# Altium project NPI1842.PrjPcb
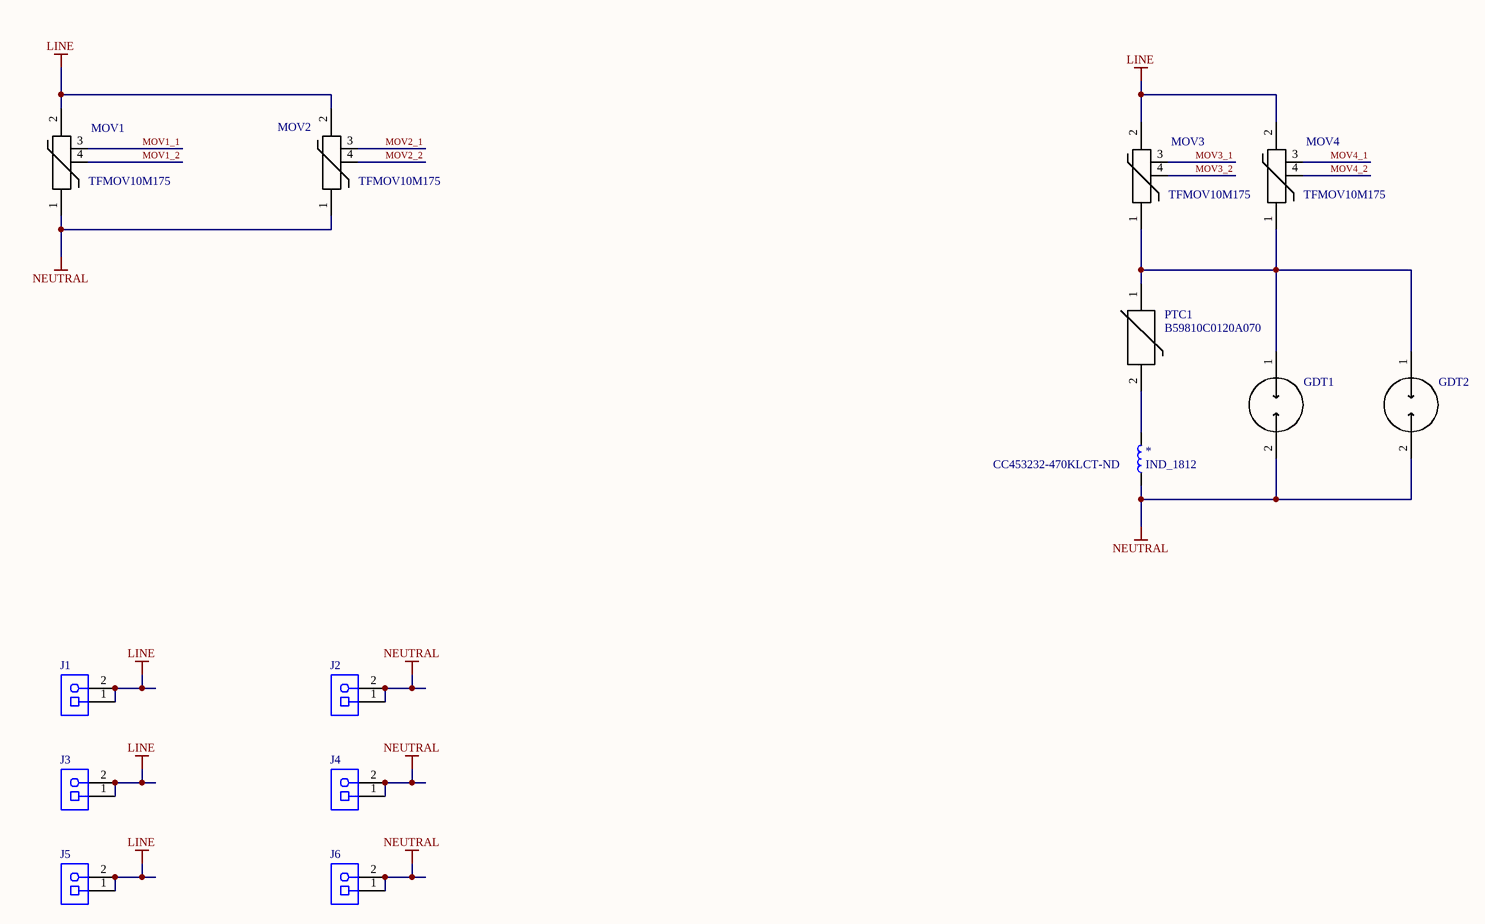
[diagram p0: Sheet1.SchDoc]
2 sheets, 75 parts. Net scope: global (net labels, ports and power ports of the same name join across sheets).
Board file: PCB1.PcbDoc
Sheets:
  Sheet1.SchDoc
  Sheet2.SchDoc

## Sheet Sheet1.SchDoc
size B; SheetNumber: 1; SheetTotal: 2

### Parts
*  IND_1812  Supplier Part Number 1: CC453232-470KLCT-ND  [IND_1812]
GDT1  B88069X2250S102  [B88069X2250S102]  (value not drawn)
GDT2  B88069X2250S102  [B88069X2250S102]  (value not drawn)
J1  1729128  [PHOE-1729128-2_V]  (value not drawn)
J2  1729128  [PHOE-1729128-2_V]  (value not drawn)
J3  1729128  [PHOE-1729128-2_V]  (value not drawn)
J4  1729128  [PHOE-1729128-2_V]  (value not drawn)
J5  1729128  [PHOE-1729128-2_V]  (value not drawn)
J6  1729128  [PHOE-1729128-2_V]  (value not drawn)
MOV1  TFMOV10M175  [TFMOV10M175]
MOV2  TFMOV10M175  [TFMOV10M175]
MOV3  TFMOV10M175  [TFMOV10M175]
MOV4  TFMOV10M175  [TFMOV10M175]
PTC1  B59810C0120A070  [B59810C0120A070]

### Nets
LINE: J1.1 J1.2 J3.1 J3.2 J5.1 J5.2 MOV1.2 MOV2.2 MOV3.2 MOV4.2
MOV1_2: MOV1.4 MOV2.4 MOV3.4 MOV4.4  [also labelled MOV2_2, MOV3_2, MOV4_2]
NEUTRAL: *.1 GDT1.2 GDT2.2 J2.1 J2.2 J4.1 J4.2 J6.1 J6.2 MOV1.1 MOV2.1
MOV1_1: MOV1.3  [project net GPIO6]
MOV2_1: MOV2.3  [project net GPIO2]
MOV3_1: MOV3.3  [project net GPIO8]
MOV4_1: MOV4.3  [project net GPIO10]
Net*_2: *.2 PTC1.2
NetGDT1_1: GDT1.1 GDT2.1 MOV3.1 MOV4.1 PTC1.1

### Library data of the parts
GDT1 GDT2 = B88069X2250S102: 230V, 20kA, 2-pole GDT
J1-J6 = CMP-2000-05815-1: PCB Terminal Block, 13.5 A, 400 V, 2-Pin THD, RoHS, Bulk; Manufacturer: Phoenix Contact; Package Version: 03/2015; No. of Rows: 1; Pitch: 5.08mm; No. of Positions: 2; Voltage Rating: 400V; Current Rating: 13500mA; Connector Type: Screw; Current: 10A; Voltage: 300V; Max Current Rating: 13.5A; Test Voltage: 4kV; Wire Gauge (Max): 26AWG; Wire Gauge (Min): 14AWG; Approvals: UL,CSA; Manufacturer URL: http://www.phoenixcontact.com/; Datasheet URL: https://datasheet.ciiva.com/16046/1729128-16046181.pdf; RoHS: TRUE; Package URL: https://www.phoenixcontact.com/online/portal/pi/pxc/product_detail_page/!ut/p/b1/3VdJjqNKFDxLH8AFycySyWY2ozFsEPOMMQaDOX1XedGL_1Vdm5YXJleknhSKeBkvI6EA8ncAo3AYoDhBQGco6KN7VURTdemj9us_IEKEZo_YHiPAEWEFmDGOHMORkqKYCORBZxgL7ZoaZYcbFFUZ3fqxSY6GOuxydWUuHqz1ynmMFygu583Bob0Ewr6Sd_l-5m-kAueHiB0jpRwZwe58wwtkpxtMYd_LmGcDRU02dRNEyWt6Y2ti5pSyJ_reIkzIulrqApdnbT11V5jnCKbYNCvhEM1MCpPByat_X379-iThf08CI5GfOPqfBeS3BRoBOdD55AKVv0iLwCMq-2BrzXWSGRH7pUGD9uwXQjiph3xL0DKQwdGa0JImiIOmBNOestqgwTHSSs2oOep-78apyXQBvNi8ZLaFjvjWvcaUEBu0MC6Wbe-d6mB0FAebo2lUWinqYaZs5DAYzV0RP9yitUjnGJ0iI9xhZkT42OCQNUJJhkgWINNQLP2JFP6OpMg3JCVg70jqHT0lvKOnhHf0lPuOnnLf0VPuWx6_dxwUIvwk5WMkT0kLL1mh61l2yZVSzG3pYV_bqo-mj6uMKwKwdnnW8Jh5RTOJzMOA5c-eJDaZQw4mTMPH02PvS_ZAqNVjVTo2WyYLkwH_KU1mmmG5kjRhDqPXLwwVHvVOjCM60-fpXvTDfMGW1PVFVS1r4e4yVDk4ZdNbkUHvqPqQSeian4UD39fNKmachqdJ1NJbyk8rXT9mXTvPk3oE5meulKGgiruPJek-4I9hTT6G8ZLOyRSm2RRVbThERQad5OS28hdt4YW4vG0stgYYzsWsK4_7y6DZMjJSCqri1kyiZR5vD7pwIrNR7QwPHTcLTI5qT7eRlpHrdGiupYlqQDJ7zy_CND8fWWBoLRXxk1RVcXiBQwbTD4Xi7KL-FuO94t9xaqweXzH; PartNumber: 1729128; Package Description: 2-Pin Through Hole Device, Body 8.1 x 10.16 mm, Pitch 5.08 mm; Datasheet Version: 12/2013; Mounting Technology: ThroughHole; Orientation: Horizontal; Package Reference: 1729128-2; Packing: Bulk; Supplier 1: Digi-Key; Manufacturer Part Number: 1729128; Category: Terminal Blocks; Stock 1: 30124; Pricing 1: 1=1.09000, 10=1.04700, 50=1.00100, 100=0.97370, 250=0.91000, 500=0.83720, 1000=0.77350, 2500=0.73710, 5000=0.69160 (USD); Mount: Through Hole; Number of Pins: 2; Color: Green; Housing Color: Green; Housing Material: Polyamide; Contact Material: Tin; Weight: 0.069842oz; Insulation Material: Nylon; Min Operating Temperature: -20°C; Max Operating Temperature: 100°C; Packaging: Bulk; Termination: Solder; Number of Positions: 2; Number of Poles: 2; Package Quantity: 50; Number of Contacts: 2; Series: MKDSN; Number of Rows: 1; Number of Levels: 1; Number of Positions Per Level: 2; Max Supply Voltage: 400V; Number of Circuits: 2; Length: 8.1mm; Width: 13.5mm; Height: 13.5mm; Depth: 8.1mm; Wire/Cable Gauge: 26AWG; Radiation Hardening: No; REACH SVHC: No SVHC; Flammability Rating: UL94 V-0; RoHS Compliant: Yes; Lead Free: Lead Free; ComponentLink1URL: https://datasheet.ciiva.com/823/1729128-823779.pdf?src-supplier=Digi-Key; ComponentLink1Description: https://datasheet.ciiva.com/823/1729128-823779.pdf?src-supplier=Digi-Key; ComponentLink2URL: https://datasheet.ciiva.com/15169/getdatasheetpartid-199310-15169845.pdf?src-supplier=Verical; ComponentLink2Description: https://datasheet.ciiva.com/15169/getdatasheetpartid-199310-15169845.pdf?src-supplier=Verical; ComponentLink3URL: https://datasheet.ciiva.com/16046/1729128-16046181.pdf?src-supplier=Onlinecomponents.com; ComponentLink3Description: https://datasheet.ciiva.com/16046/1729128-16046181.pdf?src-supplier=Onlinecomponents.com; ComponentLink4URL: https://datasheet.ciiva.com/14607/70054405-14607157.pdf?src-supplier=Allied+Electronics; ComponentLink4Description: https://datasheet.ciiva.com/14607/70054405-14607157.pdf?src-supplier=Allied+Electronics; ComponentLink5URL: https://datasheet.ciiva.com/29218/743664-da-01-en-printklemmenblock-mkdsn-1-5-2-5-08-29218154.pdf?src-supplier=Conrad; ComponentLink5Description: https://datasheet.ciiva.com/29218/743664-da-01-en-printklemmenblock-mkdsn-1-5-2-5-08-29218154.pdf?src-supplier=Conrad
MOV1-MOV4 = TFMOV10M175: TFMOV, 175V, 10KA
PTC1 = B59810C0120A070: PTC, 2.6OHM
* = IND_1812: Supplier 1: Digi-Key

## Sheet Sheet2.SchDoc
size B; SheetNumber: 2; SheetTotal: 2
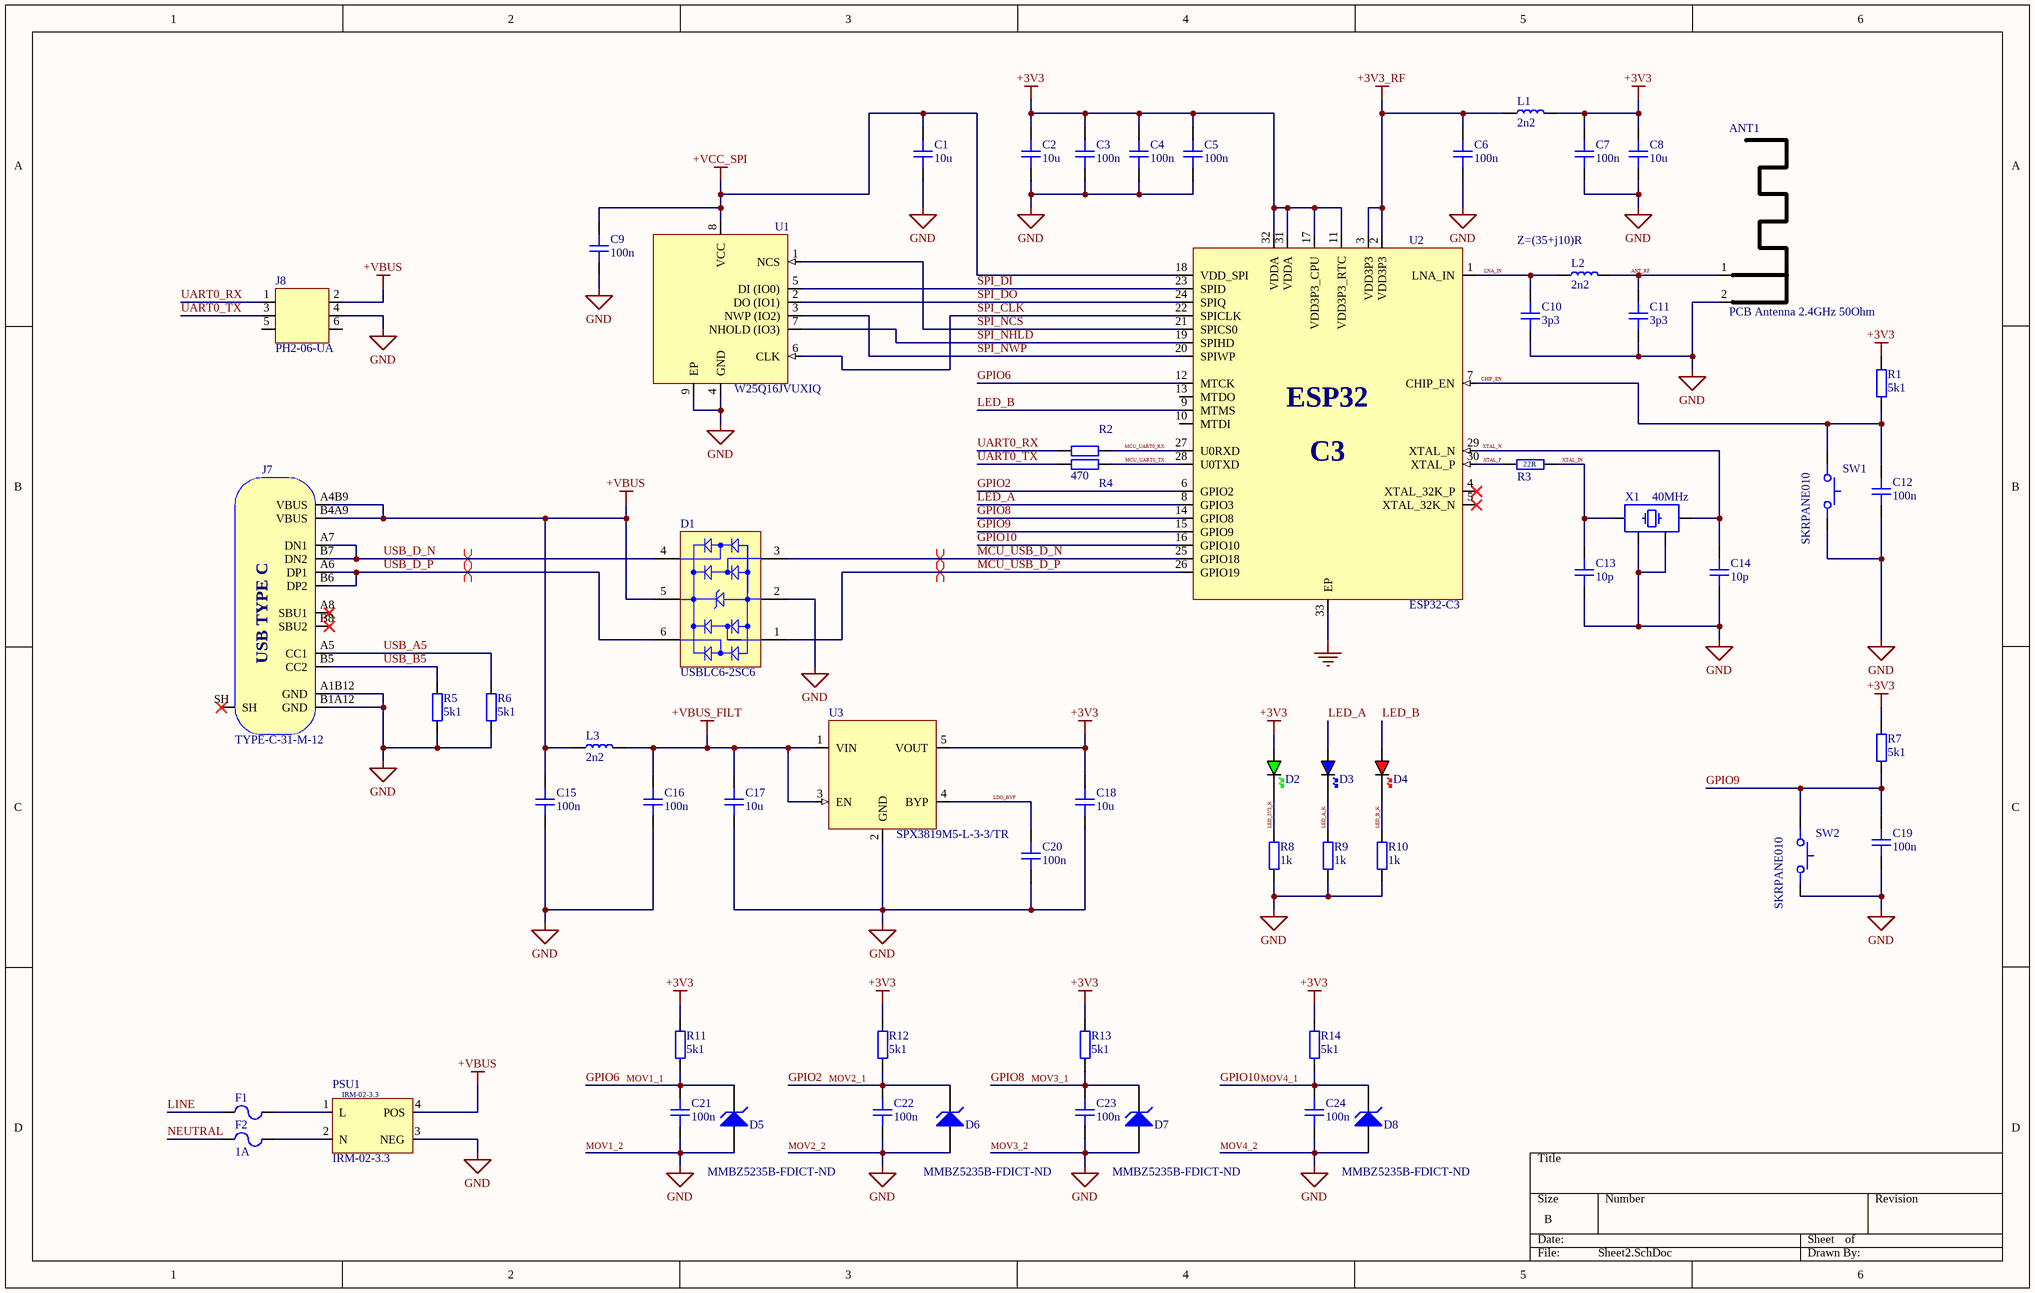
[diagram p1: Sheet2.SchDoc]

### Parts
ANT1  PCB Antenna 2.4GHz 50Ohm  [ANT_IFA_USB_2_4GHZ_50R]  (no BOM)
C1  10u  [CAP_0603]
C2  10u  [CAP_0603]
C3  100n  [CAP_0805]
C4  100n  [CAP_0805]
C5  100n  [CAP_0805]
C6  100n  [CAP_0805]
C7  100n  [CAP_0805]
C8  10u  [CAP_0603]
C9  100n  [CAP_0805]
C10  3p3  [CAP_0402]
C11  3p3  [CAP_0402]
C12  100n  [CAP_0805]
C13  10p  [CAP_0402]
C14  10p  [CAP_0402]
C15  100n  [CAP_0805]
C16  100n  [CAP_0805]
C17  10u  [CAP_0603]
C18  10u  [CAP_0603]
C19  100n  [CAP_0805]
C20  100n  [CAP_0805]
C21  100n  [CAP_0805]
C22  100n  [CAP_0805]
C23  100n  [CAP_0805]
C24  100n  [CAP_0805]
D1  USBLC6-2SC6  [STM-SOT23-6L_V]
D2  GREEN  [LED_0603_GREEN]  (value not drawn)
D3  BLUE  [LED_0603_BLUE]  (value not drawn)
D4  RED  [LED_0603_RED]  (value not drawn)
D5  Supplier Part Number 2: MMBZ5235B-FDICT-ND  [SOT23]  (hidden comment: Diode, Zener, BZX84C18)
D6  Supplier Part Number 2: MMBZ5235B-FDICT-ND  [SOT23]  (hidden comment: Diode, Zener, BZX84C18)
D7  Supplier Part Number 2: MMBZ5235B-FDICT-ND  [SOT23]  (hidden comment: Diode, Zener, BZX84C18)
D8  Supplier Part Number 2: MMBZ5235B-FDICT-ND  [SOT23]  (hidden comment: Diode, Zener, BZX84C18)
F1  1A  [FUSE_6125N]  (value not drawn)
F2  1A  [FUSE_6125N]
J7  TYPE-C-31-M-12  [TYPE-C-31-M-12]
J8  PH2-06-UA  [PH2-06-UA]
L1  2n2  [IND_0402]
L2  2n2  [IND_0402]
L3  2n2  [IND_0402]
PSU1  IRM-02-3.3  [IRM-02-3.3]
R1  5k1  [RES_0805]
R2  470  [RES_0805]  (value not drawn)
R3  22R  [RES_0402]
R4  470  [RES_0805]
R5  5k1  [RES_0805]
R6  5k1  [RES_0805]
R7  5k1  [RES_0805]
R8  1k  [RES_0805]
R9  1k  [RES_0805]
R10  1k  [RES_0805]
R11  5k1  [RES_0805]
R12  5k1  [RES_0805]
R13  5k1  [RES_0805]
R14  5k1  [RES_0805]
SW1  SKRPANE010  [SKRPANE010]
SW2  SKRPANE010  [SKRPANE010]
U1  W25Q16JVUXIQ  [USON-8-2X3MM]
U2  ESP32-C3  [QFN32-5x5]
U3  SPX3819M5-L-3-3/TR  [SOT-23-5]
X1  40MHz  [XTAL_2520]

### Nets
+3V3: C2.2 C3.2 C4.2 C5.2 C7.2 C8.2 C18.2 D2.A L1.1 R1.2 R7.2 R11.2 R12.2 R13.2 R14.2 U2.11(VDD3P3_RTC) U2.17(VDD3P3_CPU) U2.31(VDDA) U2.32(VDDA) U3.5(VOUT)
+3V3_RF: C6.2 L1.2 U2.2(VDD3P3) U2.3(VDD3P3)
+VBUS: C15.2 D1.5(VBUS) J7.A4B9(VBUS) J7.B4A9(VBUS) J8.2 L3.2 PSU1.4(POS)
+VBUS_FILT: C16.2 C17.2 L3.1 U3.1(VIN) U3.3(EN)
+VCC_SPI: C1.2 C9.2 U1.8(VCC) U2.18(VDD_SPI)
LINE: F1.1
MOV1_2: ANT1.2(GND) C1.1 C2.1 C3.1 C4.1 C5.1 C6.1 C7.1 C8.1 C9.1 C10.1 C11.1 C12.1 C13.1 C14.1 C15.1 C16.1 C17.1 C18.1 C19.1 C20.1 C21.1 C22.1 C23.1 C24.1 D1.2(GND) D5.1(A) D6.1(A) D7.1(A) D8.1(A) J7.A1B12(GND) J7.B1A12(GND) J8.4 PSU1.3(NEG) R5.1 R6.1 R8.1 R9.1 R10.1 SW1.12 SW2.12 U1.4(GND) U1.9(EP) U2.33(EP) U3.2(GND) X1.2 X1.4  [also labelled GND, MOV2_2, MOV3_2, MOV4_2]
NEUTRAL: F2.1
ANT_RF: ANT1.1(RF) C11.2 L2.1
CHIP_EN: C12.2 R1.1 SW1.34 U2.7(CHIP_EN)
GPIO2: C22.2 D6.3(K) R12.1 U2.6(GPIO2)  [also labelled MOV2_1]
GPIO6: C21.2 D5.3(K) R11.1 U2.12(MTCK)  [also labelled MOV1_1]
GPIO8: C23.2 D7.3(K) R13.1 U2.14(GPIO8)  [also labelled MOV3_1]
GPIO9: C19.2 R7.1 SW2.34 U2.15(GPIO9)
GPIO10: C24.2 D8.3(K) R14.1 U2.16(GPIO10)  [also labelled MOV4_1]
LDO_BYP: C20.2 U3.4(BYP)
LED_3V3_K: D2.K R8.2
LED_A: D3.A U2.8(GPIO3)
LED_A_K: D3.K R9.2
LED_B: D4.A U2.9(MTMS)
LED_B_K: D4.K R10.2
LNA_IN: C10.2 L2.2 U2.1(LNA_IN)
MCU_UART0_RX: R2.1 U2.27(U0RXD)
MCU_UART0_TX: R4.1 U2.28(U0TXD)
MCU_USB_D_N: D1.3(I/O_2) U2.25(GPIO18)
MCU_USB_D_P: D1.1(I/O_1) U2.26(GPIO19)
SPI_CLK: U1.6(CLK) U2.22(SPICLK)
SPI_DI: U1.5(DI_(IO0)) U2.23(SPID)
SPI_DO: U1.2(DO_(IO1)) U2.24(SPIQ)
SPI_NCS: U1.1(NCS) U2.21(SPICS0)
SPI_NHLD: U1.7(NHOLD_(IO3)) U2.19(SPIHD)
SPI_NWP: U1.3(NWP_(IO2)) U2.20(SPIWP)
UART0_RX: J8.1 R2.2
UART0_TX: J8.3 R4.2
USB_A5: J7.A5(CC1) R6.2
USB_B5: J7.B5(CC2) R5.2
USB_D_N: D1.4(I/O_3) J7.A7(DN1) J7.B7(DN2)
USB_D_P: D1.6(I/O_4) J7.A6(DP1) J7.B6(DP2)
XTAL_IN: C13.2 R3.2 X1.3
XTAL_N: C14.2 U2.29(XTAL_N) X1.1
XTAL_P: R3.1 U2.30(XTAL_P)
NetF1_2: F1.2 PSU1.1(L)
NetF2_2: F2.2 PSU1.2(N)

Not connected (* = marked no-connect by the designer): J7 A8(SBU1)* B8(SBU2)* SH*; J8 5 6; U2 4(XTAL_32K_P)* 5(XTAL_32K_N)* 10(MTDI) 13(MTDO)

### Layout directives
differential pair; differential pair class DIFF_USB: MCU_USB_D_N, MCU_USB_D_P, USB_D_N, USB_D_P

### Notes on the sheet
- (near L2) Z=(35+j10)R
- (in symbol ESP32-C3) ESP32; C3
- (in symbol TYPE-C-31-M-12) USB TYPE C

### Library data of the parts
ANT1 = ANT_IFA_USB_2_4GHZ_50R: Inverted F 2.4GHz ISM PCB Antenna 50 Ohm; ComponentLink1Description: Datasheet; ComponentLink1URL: https://www.ti.com/lit/an/swra117d/swra117d.pdf
C1 C2 C8 C17 C18 = CAP_0603_10V: Capacitor SMD 0603 10V; Manufacturer: Samsung; Manufacturer Part Number: CL10A106KP8NNNC; LCSC: C19702
C3-C7 C9 C12 C15 C16 C19-C24 = CAP_0805_50V: Capacitor SMD 0805 50V
C10 C11 = CAP_0402_50V: Capacitor SMD 0402 50V; Manufacturer: FH; Manufacturer Part Number: 0402CG3R3C500NT; LCSC: C1565
C13 C14 = CAP_0402_50V: Capacitor SMD 0402 50V; Manufacturer: Samsung; Manufacturer Part Number: CL05C100JB5NNNC; LCSC: C32949
D1 = CMP-2000-05378-1: Very low capacitance ESD protection, 3.5 pF, -40 to 125 degC, 6-Pin SOT23, RoHS, Tape and Reel; Manufacturer: STMicroelectronics; Polarity: Uni-Directional; Clamping Voltage: 17V; Rad Hardened: No; Product Height (mm): 1.3mm; Leakage Current (Max): 0.15uA; Product Length (mm): 3.05mm; Number of Elements: 1; Peak Pulse Current: 5A; Configuration: Dual; Reverse Breakdown Voltage: 6V; Working Voltage (Max): 5V; Capacitance Value: 3.5pF; Suppressor Type: DiodeArrays; Product Depth (mm): 1.75mm; Test Current (It): 1mA; Package / Case: SOT-23; Operating Temperature Max Deg. C: 125C; Package Description: 6-Pin Small Outline Transistor, Body 2.925 x 1.625 mm, Pitch 0.95 mm; Package Reference: SOT23-6L; Datasheet Version: Rev. 5, 10/2011; Operating Temperature Min Deg. C: -40C; Mounting Style: SurfaceMount; Direction Type: Uni-Directional; Mounting: SurfaceMount; Pin Count: 6; Leakage Current: 0.15uA; Packaging: TapeandReel; Operating Temperature Classification: Automotive; Clamping Voltage (Max): 17V; Manufacturer URL: http://www.st.com/; Reverse Stand-off Voltage: 5V; Datasheet URL: http://www.st.com/st-web-ui/static/active/en/resource/technical/document/datasheet/CD00050750.pdf; Working Voltage: 5V; Operating Temp Range: -40Cto125C; LCSC: C7519
D2 = LED_0603_GREEN: LED 0603 GREEN SMD; LCSC: C72043
D3 = LED_0603_BLUE: LED 0603 BLUE SMD
D4 = LED_0603_RED: LED 0603 RED SMD
D5-D8 = Diode_BZX84C18: MMBZ5235B Series 350 mW 6.8 V 10 mA Surface Mount Zener Diode - SOT-23; Manufacturer: Diodes; Manufacturer P/N: BZX84C18-7-F; Manufacturer Part Number: MMBZ5235B-7-F; Max Power Dissipation: 350mW; Zener Voltage: 18V; Max Reverse Leakage Current: 100nA; Tolerance: 6%; Zener Current: 5mA; Output Current: 18mA; Forward Voltage: 900mV; Impedance: 5R; Max Reverse Current: 3uA; Supplier 1: Digi-Key; Supplier Part Number 1: BZX84C18-FDICT-ND; Case/Package: SOT-23; Number of Pins: 3; Min Operating Temperature: -65°C; Max Operating Temperature: 150°C; Voltage Tolerance: 6%; Working Voltage: 18V; Peak Reverse Current: 100nA; Test Current: 5mA; Power Rating: 350mW; Voltage Rating (DC): 18V; Lead Free: Lead Free; ComponentLink1Description: https://datasheet.ciiva.com/8347/ds18011-8347785.pdf?src-supplier=Avnet; Supplier 2: Digi-Key; RoHS: Yes; Category: Zener Diodes; Stock 2: 50399; Pricing 2: 1=0.15, 10=0.108, 100=0.0583, 500=0.04582, 1000=0.03182 (USD); Mounting Technology: Surface Mount; Pins: 3; Weight: 0.000282oz; Package Quantity: 3000; Packaging: Tape and Reel; Power Dissipation: 350mW; Termination: SMD/SMT; Series: -; Length: 2.9mm; Width: 2.4mm; Height: 1mm; Radiation Hardening: No; RoHS Compliant: Yes; ComponentLink1URL: https://datasheet.ciiva.com/8347/ds18011-8347785.pdf?src-supplier=Avnet; ComponentLink2URL: https://datasheet.ciiva.com/890/ds18011-890886.pdf?src-supplier=Digi-Key; ComponentLink2Description: https://datasheet.ciiva.com/890/ds18011-890886.pdf?src-supplier=Digi-Key; ComponentLink3URL: https://datasheet.ciiva.com/890/ds18011-890887.pdf?src-supplier=Digi-Key; ComponentLink3Description: https://datasheet.ciiva.com/890/ds18011-890887.pdf?src-supplier=Digi-Key; ComponentLink4URL: https://datasheet.ciiva.com/890/ds18011-890888.pdf?src-supplier=Digi-Key; ComponentLink4Description: https://datasheet.ciiva.com/890/ds18011-890888.pdf?src-supplier=Digi-Key
F1 F2 = FUSE_4A_SMT: 0422001.MR; Manufacturer: Bel; Manufacturer P/N: SST4; Current Rating: 4A; Voltage Rating (AC): 125V; DC Cold Resistance: 24mR; Fuse Type: Board Mount (Cartridge Style Excluded); Approvals: CSA,CE,cULus; Supplier 1: Digi-Key; Supplier Part Number 1: 507-1070-1-ND; Mount: Surface Mount; Case/Package: SMD/SMT; Number of Pins: 2; Min Operating Temperature: -55°C; Max Operating Temperature: 125°C; Voltage Rating (DC): 125V; Length: 0.24inch; Height: 0.1inch; Width: 0.1inch; Lead Free: Lead Free; ComponentLink1URL: https://belfuse.com/resources/StewartConnector/SST.pdf?src-supplier=Digi-Key; ComponentLink1Description: https://belfuse.com/resources/StewartConnector/SST.pdf?src-supplier=Digi-Key
J7 = TYPE-C-31-M-12: USB Type C Connector Horizontal SMT; Manufacturer: Koren Hroparts; Manufacturer Part Number: TYPE-C-31-M-12; LCSC: C165948
L1-L3 = IND_0402: Inductor SMD 0402; Manufacturer: Murata; Manufacturer Part Number: LQW15AN2N2G80D; LCSC: C412264
R1 R2 R4-R14 = RES_0805: Resistor SMD 0805; Manufacturer: *; Manufacturer Part Number: *; Distributor Link: *
R3 = RES_0402: Resistor SMD 0402; Manufacturer: UNI-ROYAL; Manufacturer Part Number: 0402WGF220JTCE; LCSC: C25092
SW1 SW2 = SKRPANE010: Tactile Switch SMD SPST; Manufacturer: Alps Alpine; Manufacturer Part Number: SKRPANE010; LCSC: C470426
U1 = W25Q16JVUXIQ: 16M-BIT SERIAL FLASH MEMORY WITH / DUAL/QUAD SPI USON-8; Manufacturer: Winbond; Manufacturer Part Number: W25Q16JVUXIQ; LCSC: C2843335
U2 = ESP32-C3: Ultra­Low­Power SoC with RISC­V Single­Core CPU Supporting IEEE 802.11b/g/n (2.4 GHz Wi­Fi) and Bluetooth® 5 (LE); Manufacturer: Espressif; Manufacturer Part Number: ESP32-C3; LCSC: C2838500
U3 = SPX3819M5-L-3-3/TR: 500mA +3.3V Low-Noise LDO Voltage Regulator; Manufacturer: MaxLinear; Manufacturer Part Number: SPX3819M5-L-3-3/TR; LCSC: C9055
X1 = XTAL_2520: Crystal SMD 2520; Manufacturer: Seiko Epson; Manufacturer Number: Q24FA20H0020900; Frequency: 40MHz; LCSC: C255973

## Nets that join several sheets
LINE: Sheet1 (10 pins), Sheet2 (F1.1)
MOV1_2: Sheet1 (MOV1.4 MOV2.4 MOV3.4 MOV4.4), Sheet2 (47 pins)
NEUTRAL: Sheet1 (11 pins), Sheet2 (F2.1)
GPIO2: Sheet1 (MOV2.3), Sheet2 (C22.2 D6.3 R12.1 U2.6)
GPIO6: Sheet1 (MOV1.3), Sheet2 (C21.2 D5.3 R11.1 U2.12)
GPIO8: Sheet1 (MOV3.3), Sheet2 (C23.2 D7.3 R13.1 U2.14)
GPIO10: Sheet1 (MOV4.3), Sheet2 (C24.2 D8.3 R14.1 U2.16)